# Altium schematic sheet BANK35.SchDoc: XC7A3G-BANK35
size A4; Date: 9 AUG 2026; Engineer: Parsa Malekpour; Revision: 1.0.0; SheetNumber: 6; SheetTotal: 18
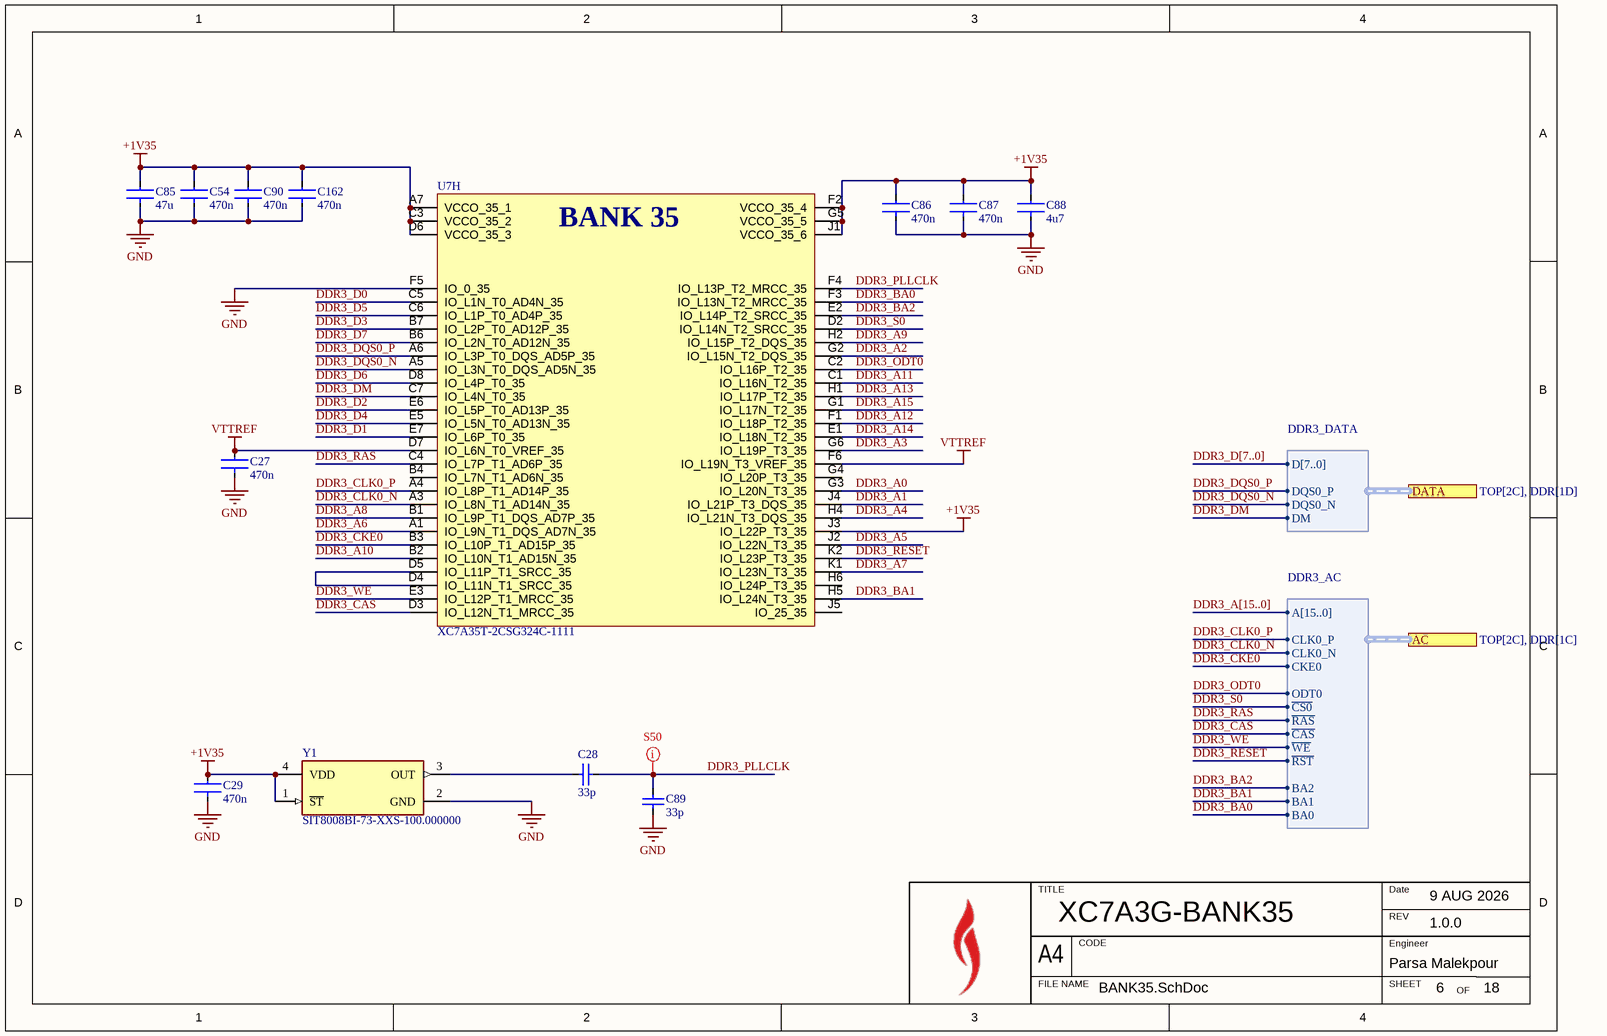
[diagram p0: BANK35.SchDoc]

## Parts
C27  value 470n  [FP-C1005-050-0_05-IPC_C]  (hidden comment: C1005X5R1E474K050BB)
C28  value 33p  [FP-C1005-050-0_05-IPC_C]  (hidden comment: C1005NP01H330J050BA)
C29  value 470n  [FP-C1005-050-0_05-IPC_C]  (hidden comment: C1005X5R1E474K050BB)
C54  value 470n  [FP-C1005-050-0_05-IPC_C]  (hidden comment: C1005X5R1E474K050BB)
C85  value 47u  [FP-C2012-125-0_2-IPC_C]  (hidden comment: C2012X5R1A476M125AC)
C86  value 470n  [FP-C1005-050-0_05-IPC_C]  (hidden comment: C1005X5R1E474K050BB)
C87  value 470n  [FP-C1005-050-0_05-IPC_C]  (hidden comment: C1005X5R1E474K050BB)
C88  value 4u7  [FP-C1005-050-0_20-0_10-IPC_C]  (hidden comment: C1005X5R1A475K050BE)
C89  value 33p  [FP-C1005-050-0_05-IPC_C]  (hidden comment: C1005NP01H330J050BA)
C90  value 470n  [FP-C1005-050-0_05-IPC_C]  (hidden comment: C1005X5R1E474K050BB)
C162  value 470n  [FP-C1005-050-0_05-IPC_C]  (hidden comment: C1005X5R1E474K050BB)
U7  XC7A35T-2CSG324C-1111  [BGA324C80P18X18_1500X1500X150]  (part H of 8)
Y1  SIT8008BI-73-XXS-100.000000  [FP-SiT8008-7-MFG]

## Ports
AC (harness DDR3_AC, see TOP[2C], DDR[1C]), DATA (harness DDR3_DATA, see TOP[2C], DDR[1D])

## Harnesses
DDR3_DATA: D[7..0], DQS0_P, DM, DQS0_N
DDR3_AC: A[15..0], CLK0_P, CKE0, CLK0_N, ODT0, ~{CS0}, ~{RAS}, ~{WE}, ~{CAS}, ~{RST}, BA2, BA1, BA0

## Nets
+1V35: C29.2 C54.2 C85.2 C86.2 C87.2 C88.2 C90.2 C162.2 U7.A7(VCCO_35_1) U7.C3(VCCO_35_2) U7.D6(VCCO_35_3) U7.F2(VCCO_35_4) U7.G5(VCCO_35_5) U7.J1(VCCO_35_6) U7.J3(IO_L22P_T3_35) Y1.1(~{ST}) Y1.4(VDD)
GND: C27.1 C29.1 C54.1 C85.1 C86.1 C87.1 C88.1 C89.1 C90.1 C162.1 U7.F5(IO_0_35) Y1.2(GND)
VTTREF: C27.2 U7.D7(IO_L6N_T0_VREF_35) U7.F6(IO_L19N_T3_VREF_35)
DDR3_A0: U7.G3(IO_L20N_T3_35)
DDR3_A1: U7.J4(IO_L21P_T3_DQS_35)
DDR3_A2: U7.G2(IO_L15N_T2_DQS_35)
DDR3_A3: U7.G6(IO_L19P_T3_35)
DDR3_A4: U7.H4(IO_L21N_T3_DQS_35)
DDR3_A5: U7.J2(IO_L22N_T3_35)
DDR3_A6: U7.A1(IO_L9N_T1_DQS_AD7N_35)
DDR3_A7: U7.K1(IO_L23N_T3_35)
DDR3_A8: U7.B1(IO_L9P_T1_DQS_AD7P_35)
DDR3_A9: U7.H2(IO_L15P_T2_DQS_35)
DDR3_A10: U7.B2(IO_L10N_T1_AD15N_35)
DDR3_A11: U7.C1(IO_L16N_T2_35)
DDR3_A12: U7.F1(IO_L18P_T2_35)
DDR3_A13: U7.H1(IO_L17P_T2_35)
DDR3_A14: U7.E1(IO_L18N_T2_35)
DDR3_A15: U7.G1(IO_L17N_T2_35)
DDR3_BA0: U7.F3(IO_L13N_T2_MRCC_35) ; port AC.BA0
DDR3_BA1: U7.H5(IO_L24N_T3_35) ; port AC.BA1
DDR3_BA2: U7.E2(IO_L14P_T2_SRCC_35) ; port AC.BA2
DDR3_CAS: U7.D3(IO_L12N_T1_MRCC_35) ; port AC.~{CAS}
DDR3_CKE0: U7.B3(IO_L10P_T1_AD15P_35) ; port AC.CKE0
DDR3_CLK0_N: U7.A3(IO_L8N_T1_AD14N_35) ; port AC.CLK0_N
DDR3_CLK0_P: U7.A4(IO_L8P_T1_AD14P_35) ; port AC.CLK0_P
DDR3_D0: U7.C5(IO_L1N_T0_AD4N_35)
DDR3_D1: U7.E7(IO_L6P_T0_35)
DDR3_D2: U7.E6(IO_L5P_T0_AD13P_35)
DDR3_D3: U7.B7(IO_L2P_T0_AD12P_35)
DDR3_D4: U7.E5(IO_L5N_T0_AD13N_35)
DDR3_D5: U7.C6(IO_L1P_T0_AD4P_35)
DDR3_D6: U7.D8(IO_L4P_T0_35)
DDR3_D7: U7.B6(IO_L2N_T0_AD12N_35)
DDR3_DM: U7.C7(IO_L4N_T0_35) ; port DATA.DM
DDR3_DQS0_N: U7.A5(IO_L3N_T0_DQS_AD5N_35) ; port DATA.DQS0_N
DDR3_DQS0_P: U7.A6(IO_L3P_T0_DQS_AD5P_35) ; port DATA.DQS0_P
DDR3_ODT0: U7.C2(IO_L16P_T2_35) ; port AC.ODT0
DDR3_PLLCLK: C28.2 C89.2 U7.F4(IO_L13P_T2_MRCC_35)
DDR3_RAS: U7.C4(IO_L7P_T1_AD6P_35) ; port AC.~{RAS}
DDR3_RESET: U7.K2(IO_L23P_T3_35) ; port AC.~{RST}
DDR3_S0: U7.D2(IO_L14N_T2_SRCC_35) ; port AC.~{CS0}
DDR3_WE: U7.E3(IO_L12P_T1_MRCC_35) ; port AC.~{WE}
NetC28_1: C28.1 Y1.3(OUT)
NetU7_D4: U7.D4(IO_L11N_T1_SRCC_35) U7.D5(IO_L11P_T1_SRCC_35)

Not connected (* = marked no-connect by the designer): U7 B4(IO_L7N_T1_AD6N_35) G4(IO_L20P_T3_35) H6(IO_L24P_T3_35) J5(IO_25_35)

## Buses and harness runs
bus DDR3_A[15..0]
bus DDR3_D[7..0]

## Layout directives
net class S50: DDR3_PLLCLK

## Notes on the sheet
- TITLE
- REV
- Date
- A4
- FILE NAME
- CODE
- SHEET
- Engineer
- OF
- (in symbol XC7A35T-2CSG324C-1111, part H) BANK 35

## Library data of the parts
C27 C29 C54 C86 C87 C90 C162 = CMP-2000-06003-2: Multilayer Ceramic Capacitors 470nF ±10% 25V X5R SMD 0402; Dissipation Factor: 10%; Case Code (Metric): 1005; RoHS Compliant: Yes; Lead Free: Lead Free; Length: 1mm; Case/Package: 0402; Termination: SMD/SMT; Voltage Rating: 25V; Dielectric Material: Ceramic; Dielectric: X5R; Depth: 0.5mm; Series: C; Voltage: 25V; Tolerance: 10%; Packaging: Tape and Reel; Resistor Type: Ceramic; Min Operating Temperature: -55°C; Width: 0.02inch; Thickness: 500um; Package Quantity: 10000; Case Code (Imperial): 0402; Construction: Flat; Height: 0.5mm; REACH SVHC: No SVHC; Radiation Hardening: No; Weight: 2.3E-05oz; Mount: Surface Mount; Voltage Rating (DC): 25V; Max Operating Temperature: 85°C; Part Number: C1005X5R1E474K050BB
C28 C89 = C1005NP01H330J050BA: Multilayer Ceramic Capacitors 33pF ±5% 50V NP0 SMD 0402; Dielectric: C0G; Case Code (Imperial): 0402; Thickness: 0.022inch; Width: 0.02inch; Case Code (Metric): 1005; Length: 0.039inch; Voltage Rating (DC): 50V; Mount: Surface Mount; Max Operating Temperature: 150°C; Height: 0.5mm; Weight: 2.3E-05oz; Voltage Rating: 50V; Case/Package: 0402; Features: High Temperature; Termination: SMD/SMT; Package Quantity: 10000; RoHS Compliant: Yes; Series: C; Tolerance: 5%; Min Operating Temperature: -55°C; Packaging: Tape and Reel; Part Number: C1005NP01H330J050BA
C85 = CMP-2000-05451-2: Multilayer Ceramic Capacitors 47μF ±20% 10V X5R SMD 0805; RoHS Compliant: Yes; Dielectric: X5R; Case Code (Imperial): 0805; Min Operating Temperature: -55°C; Length: 2mm; Voltage Rating: 10V; Lead Free: Lead Free; Weight: 0.000194oz; Resistor Type: Ceramic; Dielectric Material: Ceramic; Max Operating Temperature: 85°C; Height: 1.25mm; Width: 0.049inch; Depth: 1.25mm; Termination: SMD/SMT; Case/Package: 0805; Voltage Rating (DC): 10V; Voltage: 10V; Thickness: 0.057inch; Tolerance: 20%; REACH SVHC: No SVHC; Package Quantity: 1; Series: C; Case Code (Metric): 2012; Mount: Surface Mount; Packaging: Tape and Reel; Part Number: C2012X5R1A476M125AC
C88 = CMP-08246-007228-1: CAP CER 4.7UF 10V X5R 0402; Tolerance: 10%; Max Operating Temperature: 85°C; Case Code (Metric): 1005; Voltage Rating: 10V; Packaging: Tape and Reel; Case/Package: 0402; Features: Soft Termination; Min Operating Temperature: -55°C; Mount: Surface Mount; Case Code (Imperial): 0402; RoHS Compliant: Yes; Part Number: C1005X5R1A475K050BE
U7 = XC7A35T-2CSG324C-1111: Integrated Circuit; Manufacturer_Name: AMD; Datasheet Link: https://www.xilinx.com/support/documentation/data_sheets/ds181_Artix_7_Data_Sheet.pdf; Height: 1.5mm; Manufacturer_Part_Number: XC7A35T-2CSG324C; Mouser Part Number: 217-XC7A35T-2CSG324C; Mouser Price/Stock: https://www.mouser.co.uk/ProductDetail/AMD-Xilinx/XC7A35T-2CSG324C?qs=rrS6PyfT74fMA9%2F3WtPZmw%3D%3D
Y1 = SIT8008BI-73-XXS-100.000000: MEMS OSC XO 100.0000MHZ HCMOS